# Altium project Timegate RXTX.PrjPcb
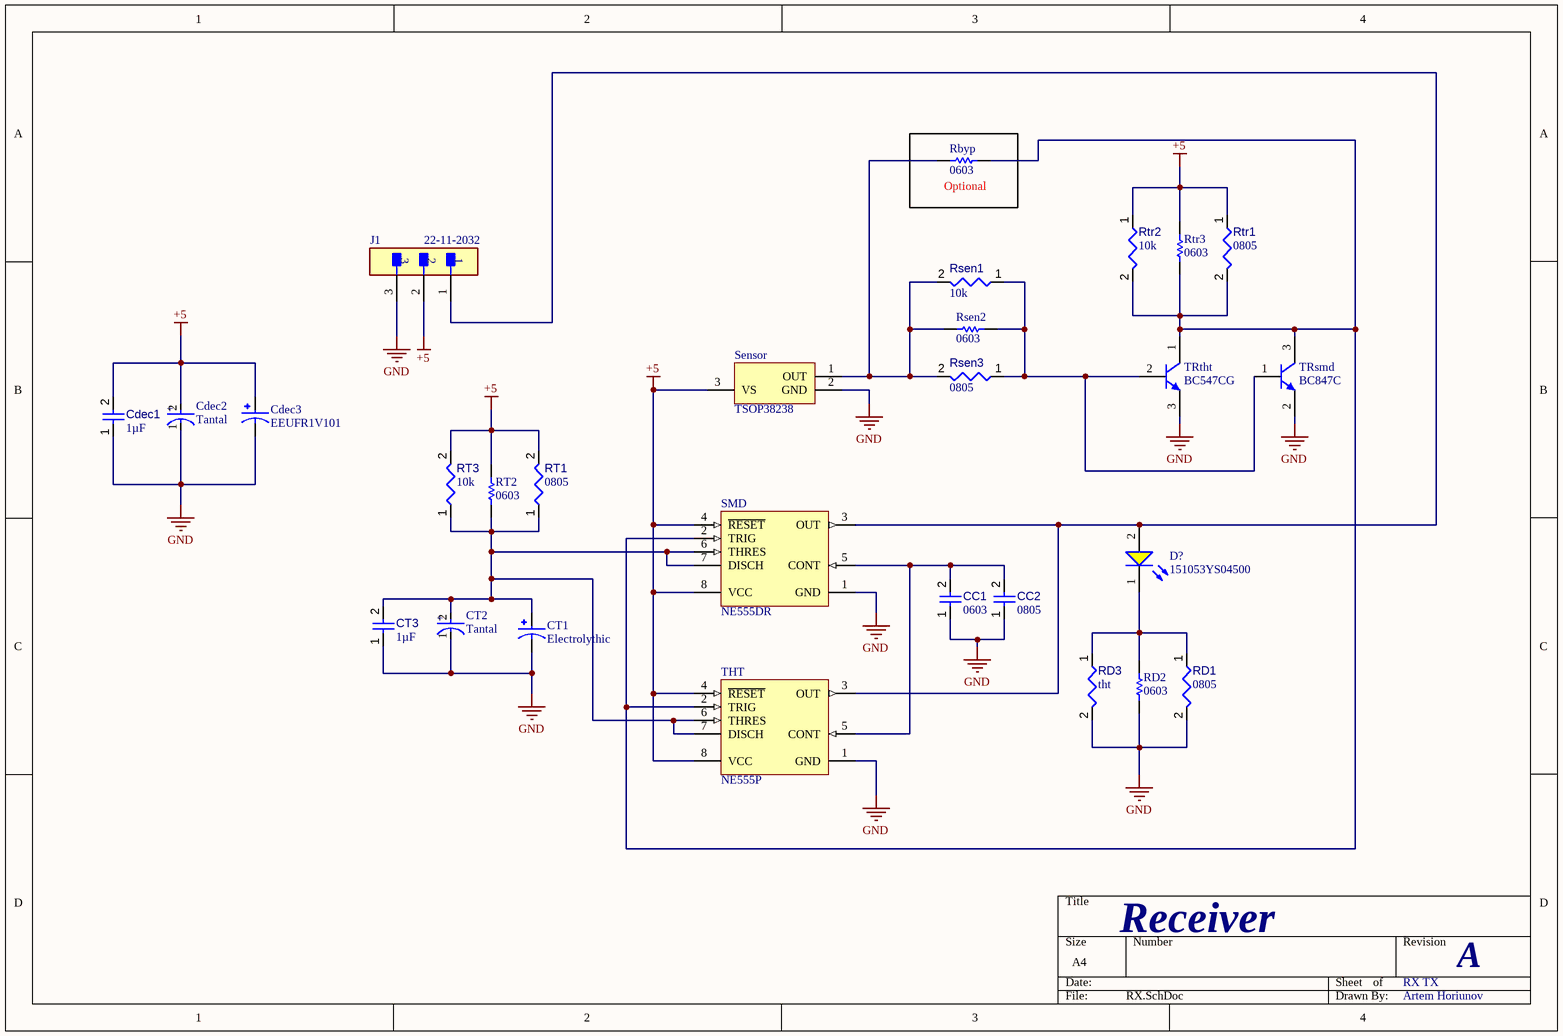
[diagram p0: RX.SchDoc]
2 sheets, 51 parts. Net scope: global (net labels, ports and power ports of the same name join across sheets).
Board files: RXTX board.PcbDoc, RX.PcbDoc, TX.PcbDoc
Sheets:
  RX.SchDoc
  TX.SchDoc

## Sheet RX.SchDoc
size A4; SheetNumber: 1; SheetTotal: 2

### Parts
CC1  value 0603  [CAPC1608X90X35ML15T15]  (hidden comment: Capacitor 1uF +/- 10% 16V 0603)
CC2  value 0805  [CAPC2013X135X45NL10T25]  (hidden comment: Capacitor 1 uF +/- 10% 50 V 0805)
Cdec1  value 1µF  [CAPC2013X135X45NL10T25]  (hidden comment: Capacitor 1 uF +/- 10% 50 V 0805)
Cdec2  Tantal  [FP-T491B107K006AT-MFG]
Cdec3  EEUFR1V101  [CAPPRD350W60D800H1150]
CT1  Electrolythic  [CAPPRD350W60D800H1150]
CT2  Tantal  [FP-T491B107K006AT-MFG]
CT3  value 1µF  [CAPC2013X135X45NL10T25]  (hidden comment: Capacitor 1 uF +/- 10% 50 V 0805)
J1  22-11-2032  [FP-22-11-2032-MFG]
LED  151053YS04500  [WL-TMRW_D5.8H11.7]
Rbyp  0603  [RESC1609X50X30NL8T20]
RD1  value 0805  [RESC0805(2012)_L]  (hidden comment: 1KR5J)
RD2  0603  [RESC1609X50X30NL8T20]
RD3  value tht  [RESA60-630X240]  (hidden comment: MFR-25FBF52-10K)
Rsen1  value 10k  [RESA60-630X240]  (hidden comment: MFR-25FBF52-10K)
Rsen2  0603  [RESC1609X50X30NL8T20]
Rsen3  value 0805  [RESC0805(2012)_L]  (hidden comment: 1KR5J)
RT1  value 0805  [RESC0805(2012)_L]  (hidden comment: 1KR5J)
RT2  0603  [RESC1609X50X30NL8T20]
RT3  value 10k  [RESA60-630X240]  (hidden comment: MFR-25FBF52-10K)
Rtr1  value 0805  [RESC0805(2012)_L]  (hidden comment: 1KR5J)
Rtr2  value 10k  [RESA60-630X240]  (hidden comment: MFR-25FBF52-10K)
Rtr3  0603  [RESC1609X50X30NL8T20]
Sensor  TSOP38238  [VISH-TSOP38238]
SMD  NE555DR  [D0008A_N]
THT  NE555P  [P0008A]
TRsmd  BC847C  [INF-SOT23_L]
TRtht  BC547CG  [ONSC-TO-92-3-29-11]

### Blocks framed on the sheet
Optional: Rbyp

### Nets
+5: Cdec1.2 Cdec2.2(A) Cdec3.P J1.2 RT1.2 RT2.2 RT3.2 Rtr1.1 Rtr2.1 Rtr3.1 Sensor.3(VS) SMD.4(~{RESET}) SMD.8(VCC) THT.4(~{RESET}) THT.8(VCC)
GND: CC1.1 CC2.1 Cdec1.1 Cdec2.1(C) Cdec3.N CT1.N CT2.1(C) CT3.1 J1.3 RD1.2 RD2.2 RD3.2 Sensor.2(GND) SMD.1(GND) THT.1(GND) TRsmd.2(E) TRtht.3(E)
NetCC1_2: CC1.2 CC2.2 SMD.5(CONT) THT.5(CONT)
NetCT1_P: CT1.P CT2.2(A) CT3.2 RT1.1 RT2.1 RT3.1 SMD.6(THRES) SMD.7(DISCH) THT.6(THRES) THT.7(DISCH)
NetJ1_1: J1.1 LED.2(A) SMD.3(OUT) THT.3(OUT)
NetLED_1: LED.1(K) RD1.1 RD2.1 RD3.1
NetRbyp_1: Rbyp.1 Rtr1.2 Rtr2.2 Rtr3.2 SMD.2(TRIG) THT.2(TRIG) TRsmd.3(C) TRtht.1(C)
NetRbyp_2: Rbyp.2 Rsen1.2 Rsen2.2 Rsen3.2 Sensor.1(OUT)
NetRsen1_1: Rsen1.1 Rsen2.1 Rsen3.1 TRsmd.1(B) TRtht.2(B)

### Notes on the sheet
- Receiver
- RX TX
- A
- Artem Horiunov
- (in symbol CMP-03017-000031-1) +

### Library data of the parts
CC1 = CMP-001-00004-6: Chip Capacitor, 1 uF, +/- 10%, 16 V, 0603 (1608 Metric); Capacitor Type: Ceramic; Mounting Technology: SM; RoHS Compliant: True; Min Operating Temperature: -55°C; Case/Package: 0603; Pins: 2; Voltage Rating: 16V; Max Operating Temperature: 125°C; Tolerance: 10%
CC2 Cdec1 CT3 = CMP-001-00007-6: Chip Capacitor, 1 uF, +/- 10%, 50 V, 0805 (2012 Metric); Capacitor Type: Ceramic; Voltage Rating: 50V; Min Operating Temperature: -55°C; RoHS Compliant: True; Mounting Technology: SM; Case/Package: 0805; Max Operating Temperature: 125°C; Tolerance: 10%; Pins: 2
Cdec2 CT2 = CMP-03017-000031-1: CAP TANT 100UF 10% 6.3V 1411; Voltage Rating (DC): 6V; ESR (Equivalent Series Resistance): 3R; Dielectric Material: Tantalum; Leakage Current: 6.3uA; Dissipation Factor: 15%; Polarity: Polar; Life (Hours): 2000Hour; Case Code (Imperial): 1411; Voltage: 6.3V; Radiation Hardening: No; Failure Rate: 0.001%; Max Operating Temperature: 125°C; Min Operating Temperature: -55°C; Voltage Rating: 6.3V; Length: 3.5mm; Depth: 2.8mm; Package Quantity: 1; Case/Package: 1411; Height - Seated (Max): 0.083inch; Termination: SMD/SMT; REACH SVHC: No SVHC; Width: 2.8mm; Mount: Surface Mount; Number of Pins: 2; Case Code (Metric): 3528; Tolerance: 10%; Lead Free: Lead Free; Capacitance: 100uF; Features: General Purpose; Height: 1.9mm; Packaging: Tape and Reel; RoHS Compliant: Yes
Cdec3 CT1 = EEUFR1V101: Aluminium Electrolytic Capacitor, Fr Series, 100 - F, - 20%, 35 V, 8 Mm, Radial Leaded; MF: Panasonic; Price: None; MP: EEUFR1V101; Value: *; Package: RADIAL-2 Panasonic; Check_prices: https://www.snapeda.com/parts/EEUFR1V101/Panasonic/view-part/2780939/?ref=eda; SnapEDA_Link: https://www.snapeda.com/parts/EEUFR1V101/Panasonic/view-part/2780939/?ref=snap; Availability: In Stock
J1 = CMP-04776-000113-1: CONN HEADER VERT 3POS 2.54MM; Manufacturer: Molex; Number Of Contacts: 3; Voltage Rating: 500V; Conn Gender: Male; Current Rating: 4A; Conn Orientation: Vertical; Device Class L2: Headers and Wire Housings; Number Of Rows: 1; Temperature Range High: +80°C; RoHS: TRUE; ComponentLink2URL: https://www.molex.com/webdocs/datasheets/pdf/en-us/0022112032_PCB_HEADERS.pdf; Manufacturer Part Number: 22-11-2032; Device Class L3: unset; Automotive: No; Temperature: -40°C to +80°C; Temperature Range Low: -40°C; Lead Free: Yes; Pitch: 2.54mm; Footprint Url: https://www.molex.com/pdm_docs/sd/022112032_sd.pdf; Digikey Description: CONN HEADER VERT 3POS 2.54MM; Contact Material: Gold,Nickel; Octopart: https://octopart.com/22-11-2032-molex-10085; Height: 10.91mm; Mouser Description: KK® 254 Solid Header, Vertical, with Friction Lock, 3 Circuits, Gold (Au) Plating; Package: 22-11-2032; Device Class L1: Connectors; Mounting Type: Through Hole; ComponentLink2Description: Datasheet; Category: Conn
LED = CMP-1477-00001-2: NexarPartId: 29717819; Peak Wavelength: 592nm; Dominant Wavelength: 590nm; Viewing Angle: 45°; Luminous Intensity: 1.5cd; Lens Style: Circular, Clear, Round; Forward Current: 100mA; Lens Size: 5mm; Color: Yellow; Test Current: 20mA; Forward Voltage: 2.1V; Max Reverse Voltage (DC): 5V
Rbyp RD2 Rsen2 RT2 Rtr3 = CMP-2000-03816-5: Chip Resistor, 0 Ohm, Jumper, 100 mW, -55 to 155 degC, 0603 (1608 Metric), RoHS, Tape and Reel; Manufacturer: Vishay Semiconductor; Voltage Rating: 75 V; Package Quantity: 5000; DatasheetVersion: 06/2012; Min Operating Temperature: -55 degC; ComponentLink1URL: http://www.vishay.com/; Mounting Technology: Surface Mount; Height: 0.45 mm; ComponentLink1Description: Manufacturer URL; REACH SVHC: Unknown; PackageReference: 0603; Packaging: Tape and Reel; Max Operating Temperature: 155 degC; Mount: Surface Mount; ComponentLink2Description: Datasheet; PackageDescription: 2-Pin Surface Mount Device, Body 1.575 x 0.85 mm; Length: 1.55 mm; ComponentLink2URL: http://www.vishay.com/docs/20035/dcrcwe3.pdf; Pins: 2; RoHSCompliant: true
RD1 Rsen3 RT1 Rtr1 = CMP-009-00076-2: 1K 0.125W 5% 0805 (2012 Metric)  SMD; Power: 125mW; Pins: 2; Mounting Technology: SMT; Tolerance: 5%; Case/Package: 0805
RD3 Rsen1 RT3 Rtr2 = CMP-009-00047-4: Axial Resistor, 10 KOhm, +/- 1%, 0.25 W, -55 to 155 degC, 2-Pin THD, RoHS, Bulk; Manufacturer: Yageo; Power: 250mW; Voltage Rating: 250V; Manufacturer URL: http://www.yageo.com/; Datasheet URL: http://www.yageo.com/documents/recent/Yageo%20LR_MFR_2013.pdf; Package Reference: MFR-25; Min Operating Temperature: -55°C; Mounting Technology: TH; Package Quantity: 200; Case/Package: Axial; Tolerance: 1%; RoHS Compliant: True; Datasheet Version: Apr-13; Packaging: Bulk; Max Operating Temperature: 155°C; Package Description: 2-Pin Axial Lead, Dia 2.4 mm, Body Length 6.3 mm
Sensor = CMP-010-00018-3: IR Receiver Modules for Remote Control System, 2.5 to 5.5 V, -25 to 85 degC, 3-Pin THD, RoHS, Bulk; Manufacturer: Vishay Semiconductor; Nominal Supply Current: 3mA; Max Supply Voltage: 5.5V; Sensor Type: Optical; Min Supply Voltage: 2.5V; Output Current: 5mA; Datasheet Version: Rev. 1.5, 07/2016; Package Reference: TSOP38238; Mounting Technology: TH; Package Description: 3-Pin Through Hole Device, Body 5.00 x 4.80 mm, Pitch 2.54 mm; Max Operating Temperature: 85°C; Package Quantity: 1500; RoHS Compliant: True; Case/Package: Axial; Min Operating Temperature: -25°C; Pins: 3; Packaging: Bulk; Datasheet URL: http://www.vishay.com/docs/82491/tsop382.pdf
SMD = CMP-016-00007-3: Precision Timer, 4.5 to 16 V, 0 to 70 degC, 8-Pin SOIC (D), Green (RoHS & no Sb/Br), Tape and Reel; Manufacturer: Texas Instruments; Max Ouput Current: -200mA; Frequency: 100kHz; Max Supply Voltage: 16V; Min Supply Voltage: 4.5V; Package Version: 4040047-3/M, 06/2011; Datasheet Version: SLFS022I, 09/2014; Datasheet URL: http://www.ti.com/general/docs/lit/getliterature.tsp?genericPartNumber=NE555&fileType=pdf; Package Reference: D0008A; Min Operating Temperature: 0°C; Case/Package: SOIC; Pins: 8; RoHS Compliant: True; Packaging: TapeandReel; Package Quantity: 2500; Package URL: http://www.ti.com/lit/ml/msoi002j/msoi002j.pdf; Package Description: 8-Pin Small Outline Integrated Circuit, Body 4.9 x 3.9 mm, Pitch 1.27 mm; Mounting Technology: SM; Max Operating Temperature: 70°C; Manufacturer URL: http://www.ti.com/
THT = CMP-2000-04954-1: Precision Timer, 4.5 to 16 V, 0 to 70 degC, 8-Pin DIP, Pb-Free, Tube; Manufacturer: TexasInstruments; Maximum High Level Output Current: -200mA; Number of Internal Timers: 1; Operating Supply Voltage: 5; Maximum Low Level Output Current: 200mA; Rad Hard: No; Packaging: Rail/Tube; Manufacturer URL: http://www.ti.com/; Package Reference: P8; Package Description: 8-Pin Double In-line Package, Body 9.59 x 6.35 mm, Pitch 2.54 mm; Package URL: http://www.ti.com/lit/ml/mpdi001b/mpdi001b.pdf; Type: Standard; Datasheet URL: http://www.ti.com/general/docs/lit/getliterature.tsp?genericPartNumber=NE555&fileType=pdf; Category: Timer; Package: 8PDIP; Datasheet Version: Rev. I, 09/2014
TRsmd = CMP-1177-00037-1: NPN Silicon AF Transistor, 45 V VCEO, 100 mA IC, SOT23, Reel, Green; Manufacturer: Infineon; VCEO (max): 45Â V; VEBO (max): 6Â V; fT (typ): 250Â MHz; VCBO (max): 50Â V; ICM (max): 200Â mA; Green: TRUE; IC (max): 100Â mA; Ptot (max): 330Â mW; ICBO (max): 15Â nA; PartNumber: BC847C; ComponentLink3URL: http://www.infineon.com/dgdl/SOT23-Package_Overview.pdf?folderId=db3a30431936bc4b0119532290053c66&fileId=db3a30431936bc4b0119533468123c85; ComponentLink3Description: Package Specification; Mounting Technology: Surface Mount; PackageDescription: 3-Pin Small Outline Transistor Package, 1.3 x 2.9 mm Body, 0.95 mm Pitch; PackageReference: SOT23; ComponentLink2URL: http://www.infineon.com/dgdl/bc847series_bc848series_bc849series_bc850series.pdf?folderId=db3a304314dca389011541d30fa21656&fileId=db3a304314dca389011541d4630a1657; ComponentLink2Description: Datasheet; ComponentLink1Description: Manufacturer URL; Polarity: NPN; ComponentLink1URL: http://www.infineon.com/; IBM (max): 200Â mA; Packing: Reel; PackageVersion: Apr-08
TRtht = CMP-1048-01464-1: Amplifier Transistor, NPN Silicon, 3-Pin TO-92, Pb-Free, Bulk Box; Manufacturer: On Semiconductor; IC Continuous (A): 0.1; fT Min (MHz): 150; ComponentLink3URL: http://www.onsemi.cn/pub_link/Collateral/2N6426-D.PDF; Mounting Technology: Through Hole; PackageReference: TO-92-3-29-11_AM_SL; ComponentLink2Description: Datasheet; RoHS: TRUE; Packing: Bulk Box; ComponentLink1Description: Manufacturer URL; PackageDescription: 3-Pin Transistor Outline, Body 4.825 x 3.685 mm, Pitch 1.27 mm; PackageVersion: Rev. AM; ComponentLink2URL: http://www.onsemi.com/pub_link/Collateral/BC546-D.PDF; ComponentLink3Description: Package Specification; ComponentLink1URL: http://www.onsemi.com/; DatasheetVersion: Rev. 7; Polarity: NPN; PartNumber: BC547CG

## Sheet TX.SchDoc
size A4; SheetNumber: 2; SheetTotal: 2
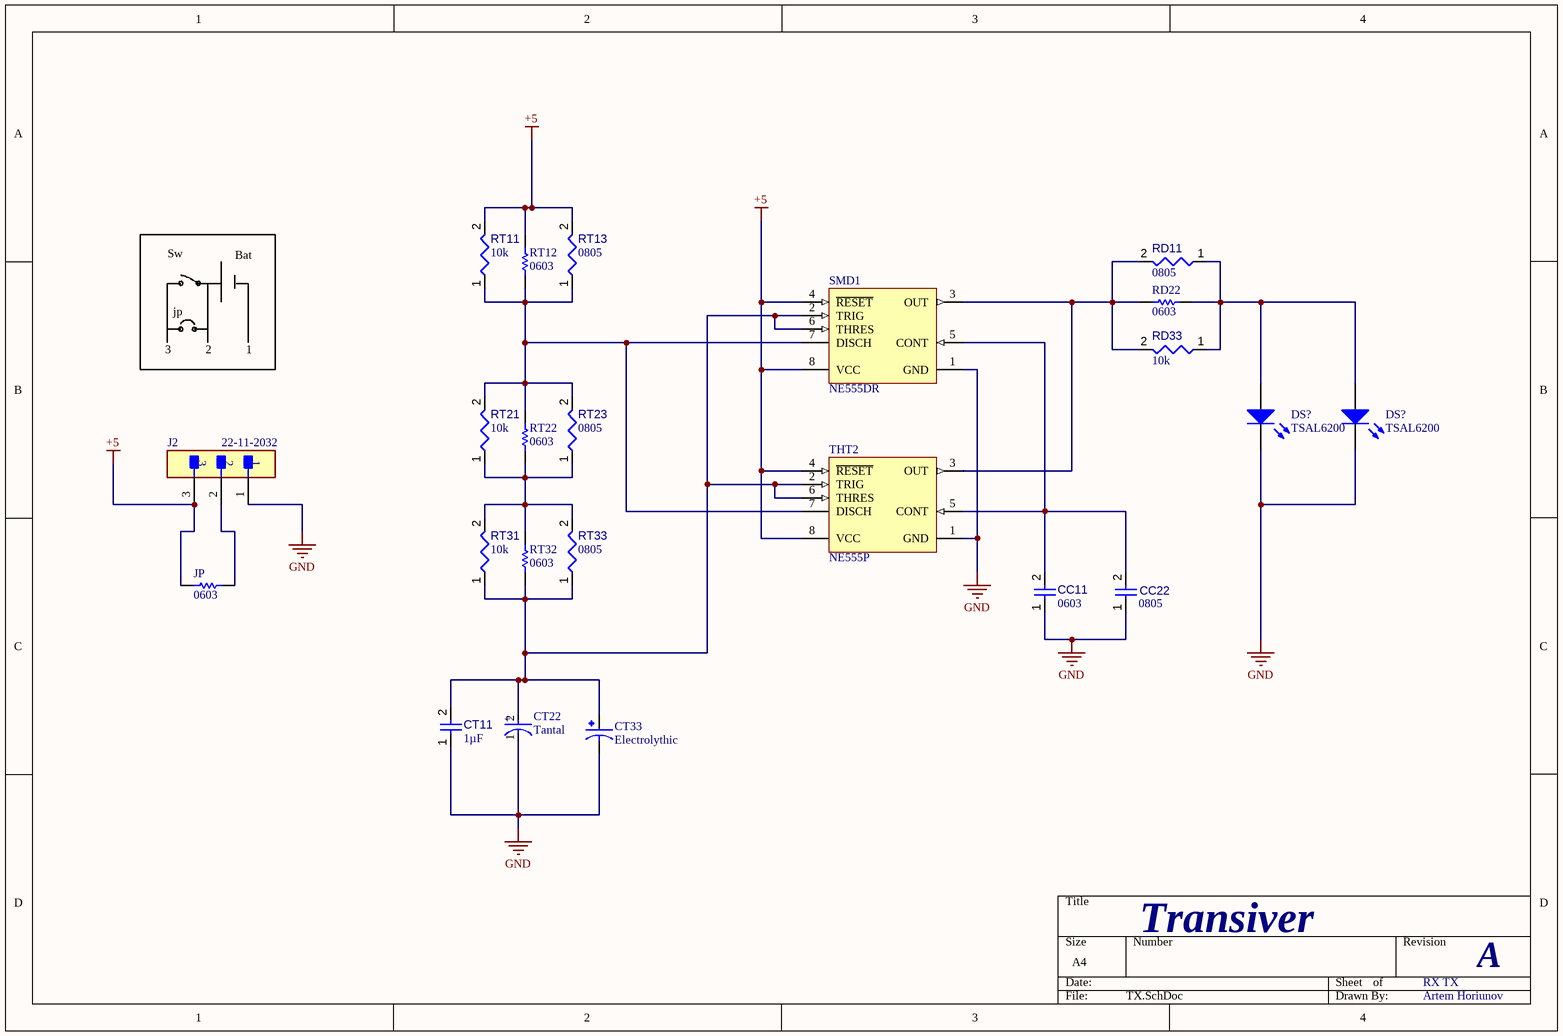
[diagram p1: TX.SchDoc]

### Parts
(Parts that share a designator on the sheet are numbered #1, #2 ... from top to bottom, then left to right.)
CC11  value 0603  [CAPC1608X90X35ML15T15]  (hidden comment: Capacitor 1uF +/- 10% 16V 0603)
CC22  value 0805  [CAPC2013X135X45NL10T25]  (hidden comment: Capacitor 1 uF +/- 10% 50 V 0805)
CT11  value 1µF  [CAPC2013X135X45NL10T25]  (hidden comment: Capacitor 1 uF +/- 10% 50 V 0805)
CT22  Tantal  [FP-T491B107K006AT-MFG]
CT33  Electrolythic  [CAPPRD350W60D800H1150]
DS?#1  TSAL6200  [VISH-TSAL6200]
DS?#2  TSAL6200  [VISH-TSAL6200]
J2  22-11-2032  [FP-22-11-2032-MFG]
JP  0603  [RESC1609X50X30NL8T20]
RD11  value 0805  [RESC0805(2012)_L]  (hidden comment: 1KR5J)
RD22  0603  [RESC1609X50X30NL8T20]
RD33  value 10k  [RESA60-630X240]  (hidden comment: MFR-25FBF52-10K)
RT11  value 10k  [RESA60-630X240]  (hidden comment: MFR-25FBF52-10K)
RT12  0603  [RESC1609X50X30NL8T20]
RT13  value 0805  [RESC0805(2012)_L]  (hidden comment: 1KR5J)
RT21  value 10k  [RESA60-630X240]  (hidden comment: MFR-25FBF52-10K)
RT22  0603  [RESC1609X50X30NL8T20]
RT23  value 0805  [RESC0805(2012)_L]  (hidden comment: 1KR5J)
RT31  value 10k  [RESA60-630X240]  (hidden comment: MFR-25FBF52-10K)
RT32  0603  [RESC1609X50X30NL8T20]
RT33  value 0805  [RESC0805(2012)_L]  (hidden comment: 1KR5J)
SMD1  NE555DR  [D0008A_N]
THT2  NE555P  [P0008A]

### Nets
+5: J2.3 JP.2 RT11.2 RT12.2 RT13.2 SMD1.4(~{RESET}) SMD1.8(VCC) THT2.4(~{RESET}) THT2.8(VCC)
GND: CC11.1 CC22.1 CT11.1 CT22.1(C) CT33.N DS?#1.2(K) DS?#2.2(K) J2.1 SMD1.1(GND) THT2.1(GND)
NetCC11_2: CC11.2 CC22.2 SMD1.5(CONT) THT2.5(CONT)
NetCT11_2: CT11.2 CT22.2(A) CT33.P RT31.1 RT32.1 RT33.1 SMD1.2(TRIG) SMD1.6(THRES) THT2.2(TRIG) THT2.6(THRES)
NetDS?#1_1: DS?#1.1(A) DS?#2.1(A) RD11.1 RD22.1 RD33.1
NetJ2_2: J2.2 JP.1
NetRD11_2: RD11.2 RD22.2 RD33.2 SMD1.3(OUT) THT2.3(OUT)
NetRT11_1: RT11.1 RT12.1 RT13.1 RT21.2 RT22.2 RT23.2 SMD1.7(DISCH) THT2.7(DISCH)
NetRT21_1: RT21.1 RT22.1 RT23.1 RT31.2 RT32.2 RT33.2

### Notes on the sheet
- Sw
- jp
- Bat
- 3
- 2
- 1
- Transiver
- RX TX
- A
- Artem Horiunov
- (in symbol CMP-03017-000031-1) +

### Library data of the parts
CC11 = CMP-001-00004-6: as CC1 on sheet RX; Mounting Technology: SM; RoHS Compliant: True; Min Operating Temperature: -55°C; Case/Package: 0603; Pins: 2; Voltage Rating: 16V; Max Operating Temperature: 125°C; Tolerance: 10%
CC22 CT11 = CMP-001-00007-6: as CC2 on sheet RX; Min Operating Temperature: -55°C; RoHS Compliant: True; Mounting Technology: SM; Case/Package: 0805; Max Operating Temperature: 125°C; Tolerance: 10%; Pins: 2
CT22 = CMP-03017-000031-1: as Cdec2 on sheet RX; Case Code (Imperial): 1411; Voltage: 6.3V; Radiation Hardening: No; Failure Rate: 0.001%; Max Operating Temperature: 125°C; Min Operating Temperature: -55°C; Voltage Rating: 6.3V; Length: 3.5mm; Depth: 2.8mm; Package Quantity: 1; Case/Package: 1411; Height - Seated (Max): 0.083inch; Termination: SMD/SMT; REACH SVHC: No SVHC; Width: 2.8mm; Mount: Surface Mount; Number of Pins: 2; Case Code (Metric): 3528; Tolerance: 10%; Lead Free: Lead Free; Capacitance: 100uF; Features: General Purpose; Height: 1.9mm; Packaging: Tape and Reel; RoHS Compliant: Yes
CT33 = EEUFR1V101: as Cdec3 on sheet RX; Price: None; MP: EEUFR1V101; Value: *; Package: RADIAL-2 Panasonic; Check_prices: https://www.snapeda.com/parts/EEUFR1V101/Panasonic/view-part/2780939/?ref=eda; SnapEDA_Link: https://www.snapeda.com/parts/EEUFR1V101/Panasonic/view-part/2780939/?ref=snap; Availability: In Stock
DS?#1 DS?#2 = CMP-2000-07327-1: High Power Infrared Emitting Diode, GaAlAs, MQW, 1.35 V, 100 mA, -40 to 85 degC, 2-Pin THD, RoHS, Bulk; Manufacturer: Vishay; Lum Intensity: 500mW/srmcd; Product Depth (mm): 5.8mm; Type: IrLED; Luminous Intensity: 500mW/sr; Forward Voltage: 3V; Shape Type: Circular; Peak Wavelength: 950nm; Rad Hardened: No; Product Height (mm): 8.7mm; Number of  Elements: 1; Forward Current: 100mA; High Brightness: Yes; Reverse Voltage: 5V; DELETED: Compliant; Power Dissipation: 160W; Viewing Angle: 34deg; Lens Type: Colored; Packaging: Bulk; Lens Dimensions: 5x5x7.7mm; Package Reference: TSAL6200; Chip Material: GaAlAs; Package Description: 2-Pin Through Hole Device, Dia 5.8 mm, Pitch 2.54 mm; Main Category: IrLED; Manufacturer URL: http://www.vishay.com/; Product Length (mm): 5.8mm; Datasheet URL: http://www.vishay.com/docs/81010/tsal6200.pdf; Operating Temperature Classification: Industrial; Package Type: T-13/4; Pin Count: 2; Mounting: ThroughHole; Mounting Technology: ThroughHole; Test Current (It): 100mA; Datasheet Version: Rev. 2.4, 03/2014; Operating Temp Range: -40Cto85C
J2 = CMP-04776-000113-1: as J1 on sheet RX; Device Class L2: Headers and Wire Housings; Number Of Rows: 1; Temperature Range High: +80°C; RoHS: TRUE; ComponentLink2URL: https://www.molex.com/webdocs/datasheets/pdf/en-us/0022112032_PCB_HEADERS.pdf; Manufacturer Part Number: 22-11-2032; Device Class L3: unset; Automotive: No; Temperature: -40°C to +80°C; Temperature Range Low: -40°C; Lead Free: Yes; Pitch: 2.54mm; Footprint Url: https://www.molex.com/pdm_docs/sd/022112032_sd.pdf; Digikey Description: CONN HEADER VERT 3POS 2.54MM; Contact Material: Gold,Nickel; Octopart: https://octopart.com/22-11-2032-molex-10085; Height: 10.91mm; Mouser Description: KK® 254 Solid Header, Vertical, with Friction Lock, 3 Circuits, Gold (Au) Plating; Package: 22-11-2032; Device Class L1: Connectors; Mounting Type: Through Hole; ComponentLink2Description: Datasheet; Category: Conn
JP RD22 RT12 RT22 RT32 = CMP-2000-03816-5: as Rbyp on sheet RX; Package Quantity: 5000; DatasheetVersion: 06/2012; Min Operating Temperature: -55 degC; ComponentLink1URL: http://www.vishay.com/; Mounting Technology: Surface Mount; Height: 0.45 mm; ComponentLink1Description: Manufacturer URL; REACH SVHC: Unknown; PackageReference: 0603; Packaging: Tape and Reel; Max Operating Temperature: 155 degC; Mount: Surface Mount; ComponentLink2Description: Datasheet; PackageDescription: 2-Pin Surface Mount Device, Body 1.575 x 0.85 mm; Length: 1.55 mm; ComponentLink2URL: http://www.vishay.com/docs/20035/dcrcwe3.pdf; Pins: 2; RoHSCompliant: true
RD11 RT13 RT23 RT33 = CMP-009-00076-2: as RD1 on sheet RX; Pins: 2; Mounting Technology: SMT; Tolerance: 5%; Case/Package: 0805
RD33 RT11 RT21 RT31 = CMP-009-00047-4: as RD3 on sheet RX; Manufacturer URL: http://www.yageo.com/; Datasheet URL: http://www.yageo.com/documents/recent/Yageo%20LR_MFR_2013.pdf; Package Reference: MFR-25; Min Operating Temperature: -55°C; Mounting Technology: TH; Package Quantity: 200; Case/Package: Axial; Tolerance: 1%; RoHS Compliant: True; Datasheet Version: Apr-13; Packaging: Bulk; Max Operating Temperature: 155°C; Package Description: 2-Pin Axial Lead, Dia 2.4 mm, Body Length 6.3 mm
SMD1 = CMP-016-00007-3: as SMD on sheet RX; Datasheet Version: SLFS022I, 09/2014; Datasheet URL: http://www.ti.com/general/docs/lit/getliterature.tsp?genericPartNumber=NE555&fileType=pdf; Package Reference: D0008A; Min Operating Temperature: 0°C; Case/Package: SOIC; Pins: 8; RoHS Compliant: True; Packaging: TapeandReel; Package Quantity: 2500; Package URL: http://www.ti.com/lit/ml/msoi002j/msoi002j.pdf; Package Description: 8-Pin Small Outline Integrated Circuit, Body 4.9 x 3.9 mm, Pitch 1.27 mm; Mounting Technology: SM; Max Operating Temperature: 70°C; Manufacturer URL: http://www.ti.com/
THT2 = CMP-2000-04954-1: as THT on sheet RX; Packaging: Rail/Tube; Manufacturer URL: http://www.ti.com/; Package Reference: P8; Package Description: 8-Pin Double In-line Package, Body 9.59 x 6.35 mm, Pitch 2.54 mm; Package URL: http://www.ti.com/lit/ml/mpdi001b/mpdi001b.pdf; Type: Standard; Datasheet URL: http://www.ti.com/general/docs/lit/getliterature.tsp?genericPartNumber=NE555&fileType=pdf; Category: Timer; Package: 8PDIP; Datasheet Version: Rev. I, 09/2014

## Nets that join several sheets
+5: RX (15 pins), TX (9 pins)
GND: RX (17 pins), TX (10 pins)